# EAGLE design IO4-LED-Strip-Driver (EAGLE 7.7.0)
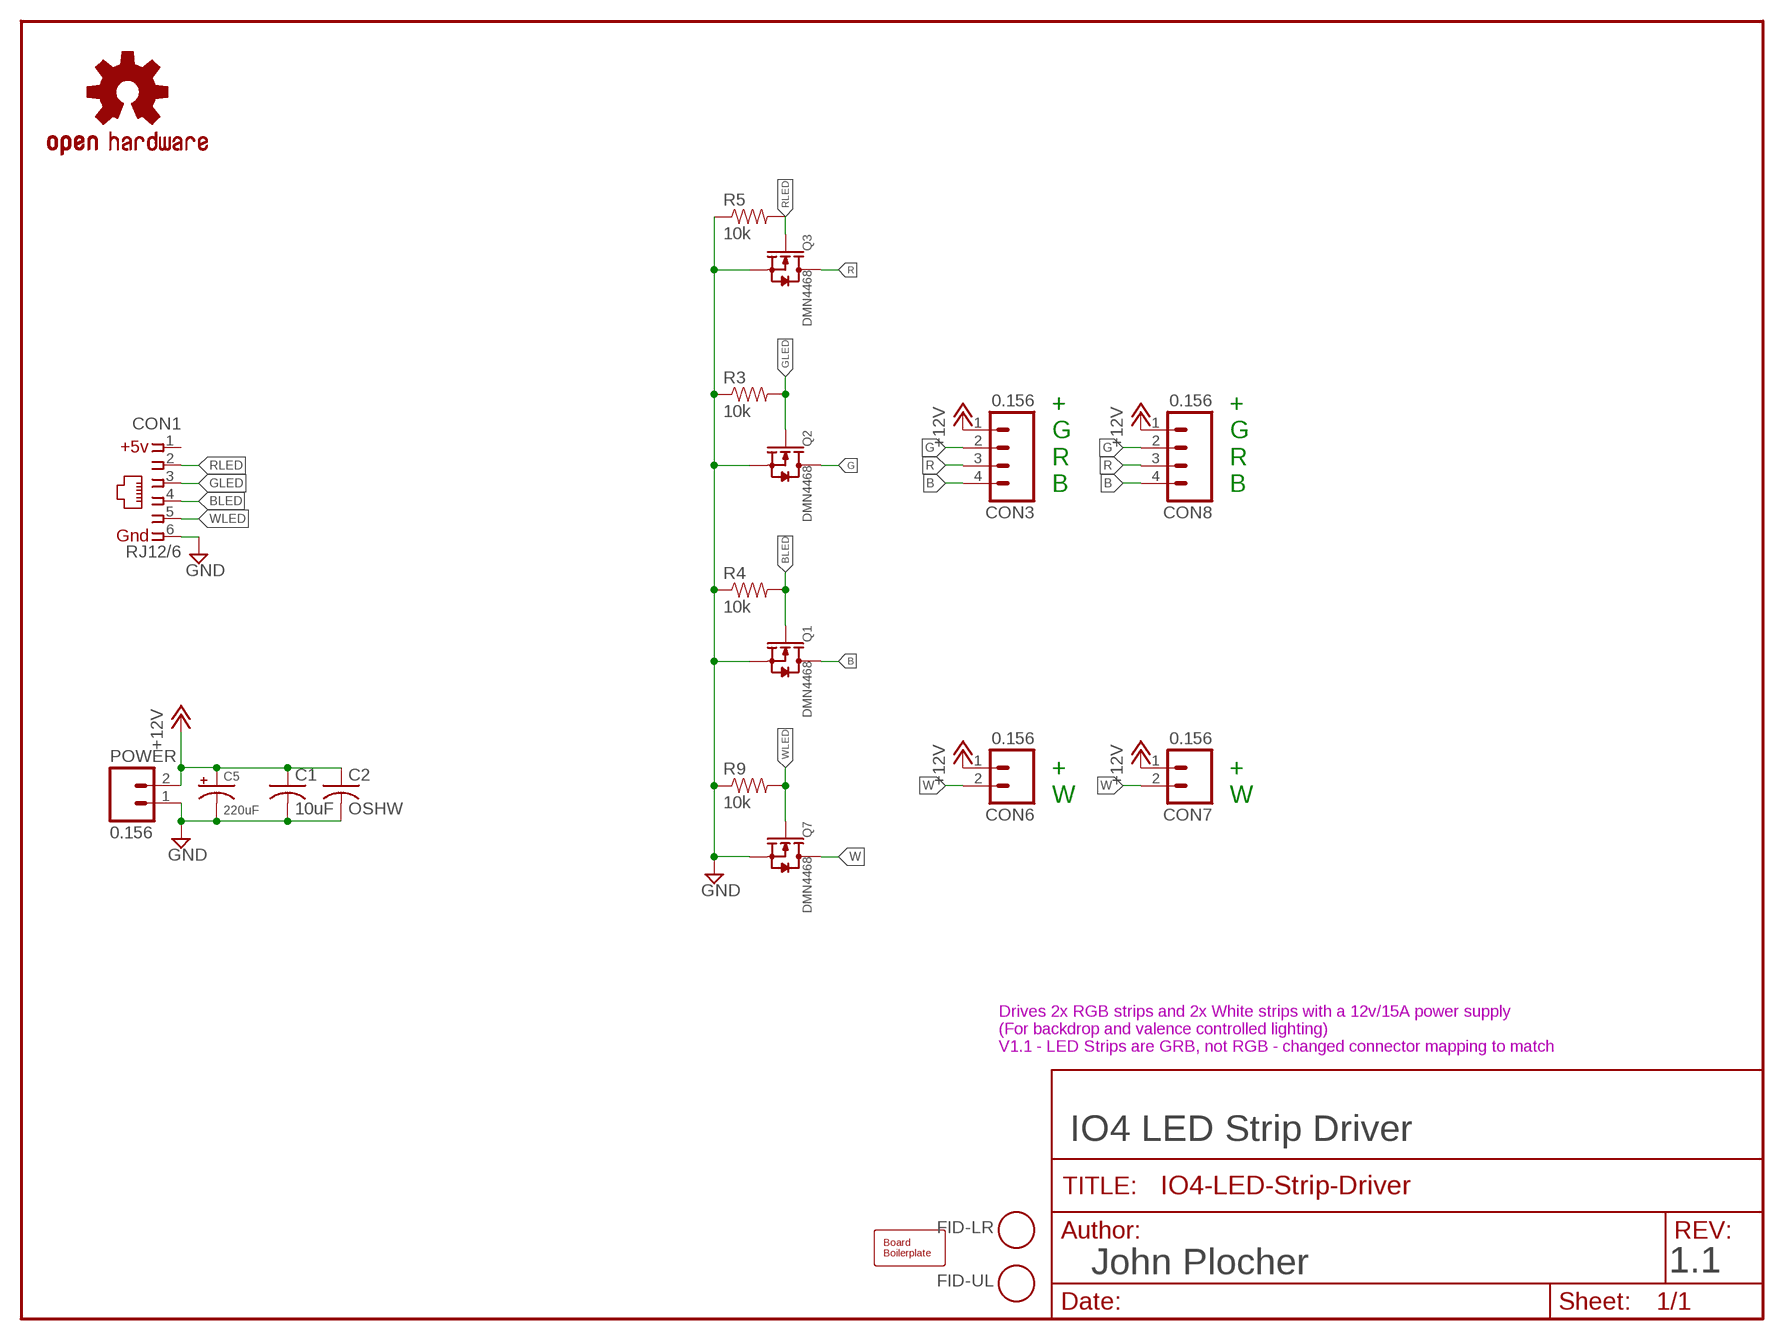
[diagram p0: schematic, sheet 1]

## Parts
BOARD1  BOARD  BOARD80X100  [BOARD-DINRAIL-3.17INX10CM]
C1  10uF  CAP0603  [0603-CAP]
C2  OSHW  CAP0603  [0603-CAP]
C5  220uF  CAP-POL0810  [0810-CAP]
CON1  RJ12/6  CONNECTOR-IO4INV  [RJ25-INVERTED]
CON3  0.156  CONNECTOR-M045.08  [MSTBA4]
CON6  0.156  CONNECTOR-M02MSTBA2  [MSTBA2]
CON7  0.156  CONNECTOR-M02MSTBA2  [MSTBA2]
CON8  0.156  CONNECTOR-M045.08  [MSTBA4]
FID-LR  FIDUCIAL  [FIDUCIAL_1MM]
FID-UL  FIDUCIAL  [FIDUCIAL_1MM]
OSHW1  OSHW  OSHW-LOGOL  [OSHW-LOGO-L]
POWER  0.156  CONNECTOR-M02MSTBA2  [MSTBA2]
Q1  DMN4468  MOSFET-N--SO8  [SO08]
Q2  DMN4468  MOSFET-N--SO8  [SO08]
Q3  DMN4468  MOSFET-N--SO8  [SO08]
Q7  DMN4468  MOSFET-N--SO8  [SO08]
R3  10k  R0603-RES  [0603-RES]
R4  10k  R0603-RES  [0603-RES]
R5  10k  R0603-RES  [0603-RES]
R9  10k  R0603-RES  [0603-RES]

## Nets
+12V [Feed]: C1.1 C2.1 C5.+ CON3.1 CON6.1(A) CON7.1(A) CON8.1 POWER.2(B)
B: CON3.4 CON8.4 Q1.5(D) Q1.6(D) Q1.7(D) Q1.8(D)
BLED: CON1.4 Q1.4(G) R4.2
G: CON3.2 CON8.2 Q2.5(D) Q2.6(D) Q2.7(D) Q2.8(D)
GLED: CON1.3 Q2.4(G) R3.2
GND: C1.2 C2.2 C5.- CON1.6 POWER.1(A) Q1.1(S) Q1.2(S) Q1.3(S) Q2.1(S) Q2.2(S) Q2.3(S) Q3.1(S) Q3.2(S) Q3.3(S) Q7.1(S) Q7.2(S) Q7.3(S) R3.1 R4.1 R5.1 R9.1
R: CON3.3 CON8.3 Q3.5(D) Q3.6(D) Q3.7(D) Q3.8(D)
RLED: CON1.2 Q3.4(G) R5.2
W: CON6.2(B) CON7.2(B) Q7.5(D) Q7.6(D) Q7.7(D) Q7.8(D)
WLED: CON1.5 Q7.4(G) R9.2

## Notes on the sheet
- +
  G
  R
  B
- +
  G
  R
  B
- +
  W
- +
  W
- Drives 2x RGB strips and 2x White strips with a 12v/15A power supply
  (For backdrop and valence controlled lighting)
  V1.1 - LED Strips are GRB, not RGB - changed connector mapping to match
- IO4 LED Strip Driver
- John Plocher | 1.1

## Power pins joined to a net without a drawn wire
1: CON1.1

## Library data of the parts
BOARD1 = SPCoast:BOARD
C1 C2 = SPCoast:CAP*
C5 = SPCoast:CAP-POL*
CON1 = SPCoast:CONNECTOR-IO4
CON3 CON8 = SPCoast:CONNECTOR-M04: Header 4 Standard 4-pin 0.1" header. Use with straight break away headers (SKU : PRT-00116), right angle break away headers (PRT-00553), swiss pins (PRT-00743), machine pins (PRT-00117), and female headers (PRT-00115). Molex polarized connector foot print use with SKU : PRT-08231 with associated crimp pins and housings. 1MM SMD Version SKU: PRT-10208
CON6 CON7 POWER = SPCoast:CONNECTOR-M02: PHOENIX CONNECTOR
FID-LR FID-UL = SPCoast:FIDUCIAL: For use by pick and place machines to calibrate the vision/machine, 1mm By microbuilder.eu
OSHW1 = SparkFun:OSHW-LOGO: Open Source Hardware Logo This logo indicates the piece of hardware it is found on incorporates a OSHW license and/or adheres to the definition of open source hardware found here: http://freedomdefined.org/OSHW
Q1-Q3 Q7 = SPCoast:MOSFET-N-*-?: CJ2302：SMD MOSFET N-CH 20V-2.1A DMN4468 - SO8 30v/10A
R3-R5 R9 = SPCoast:R*: Resistor Basic schematic elements and footprints for 0603, 1206, and PTH 1/10th watt (small) resistors.

## Net classes
0 default: width 0.254 mm, drill 0.5 mm, clearance 0.203 mm
1 Power: width 0.406 mm, drill 0.6 mm, clearance 0.203 mm
2 signals: width 0.305 mm, drill 0.6 mm, clearance 0.203 mm
3 Feed: width 1.016 mm, drill 1.4 mm, clearance 0.203 mm

## Board
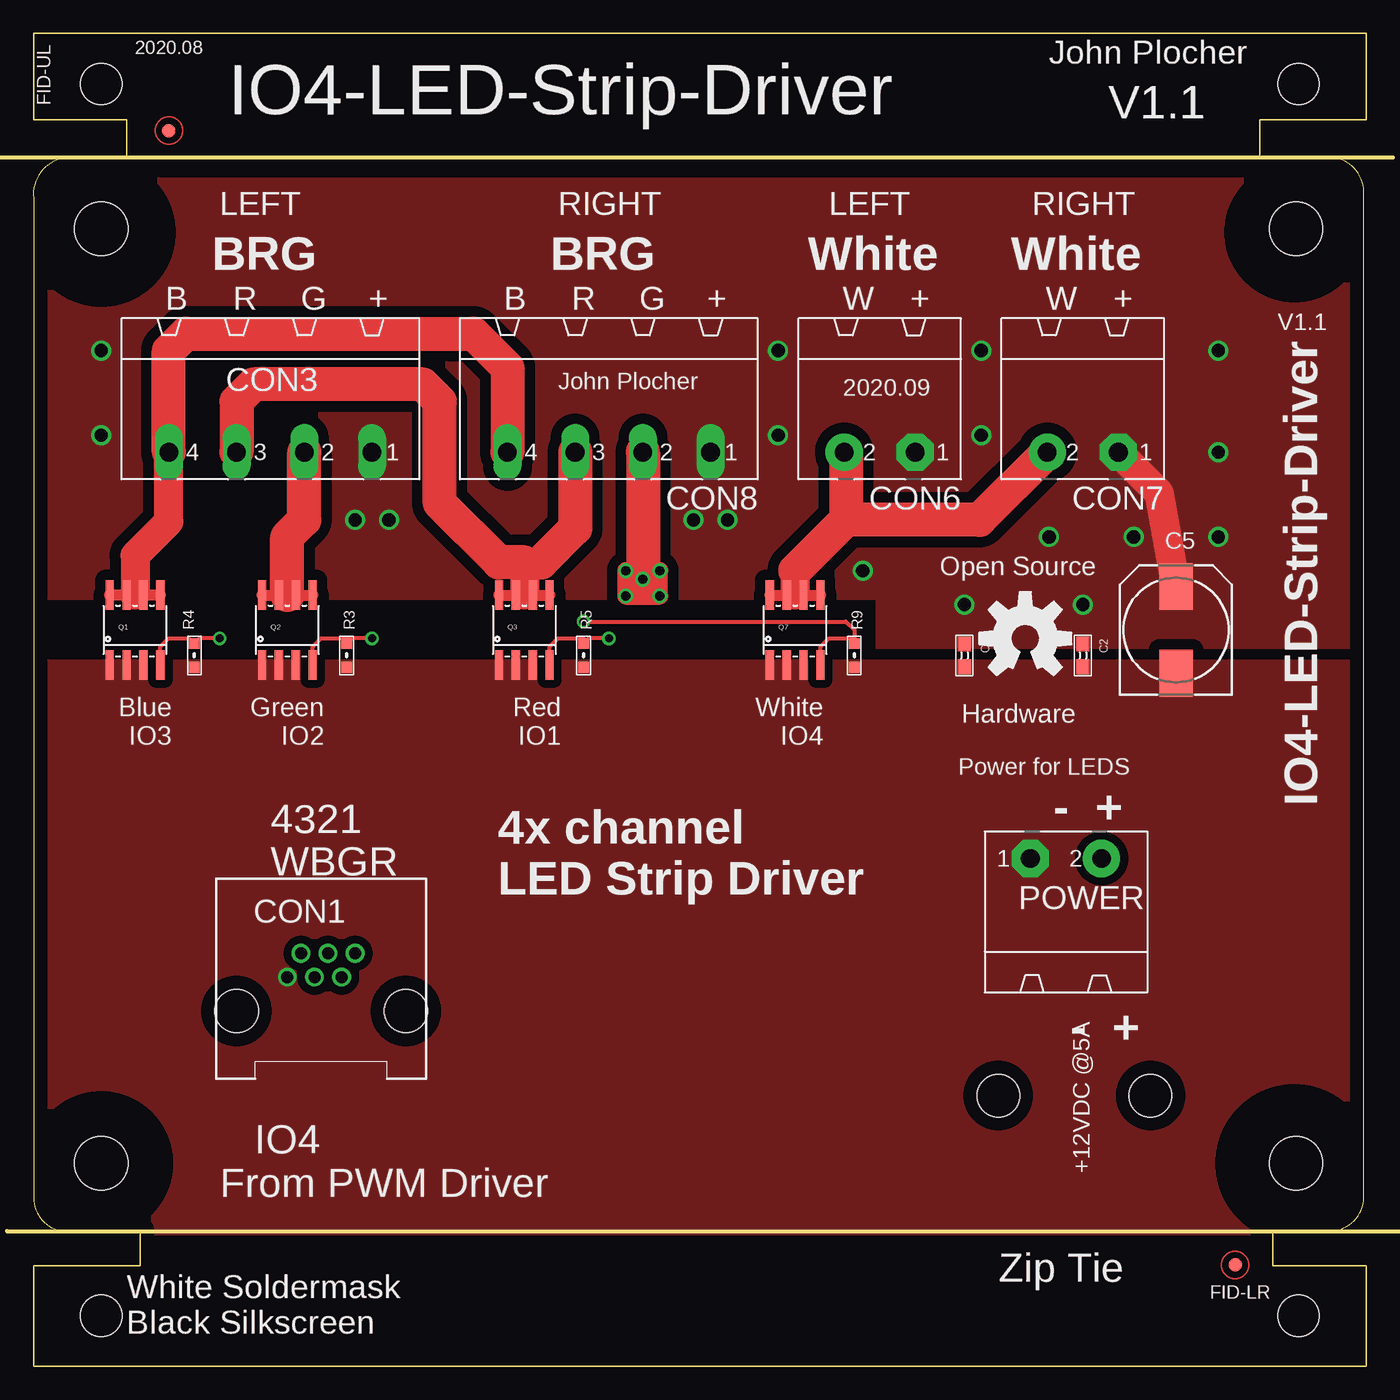
[diagram p1: board, top side]
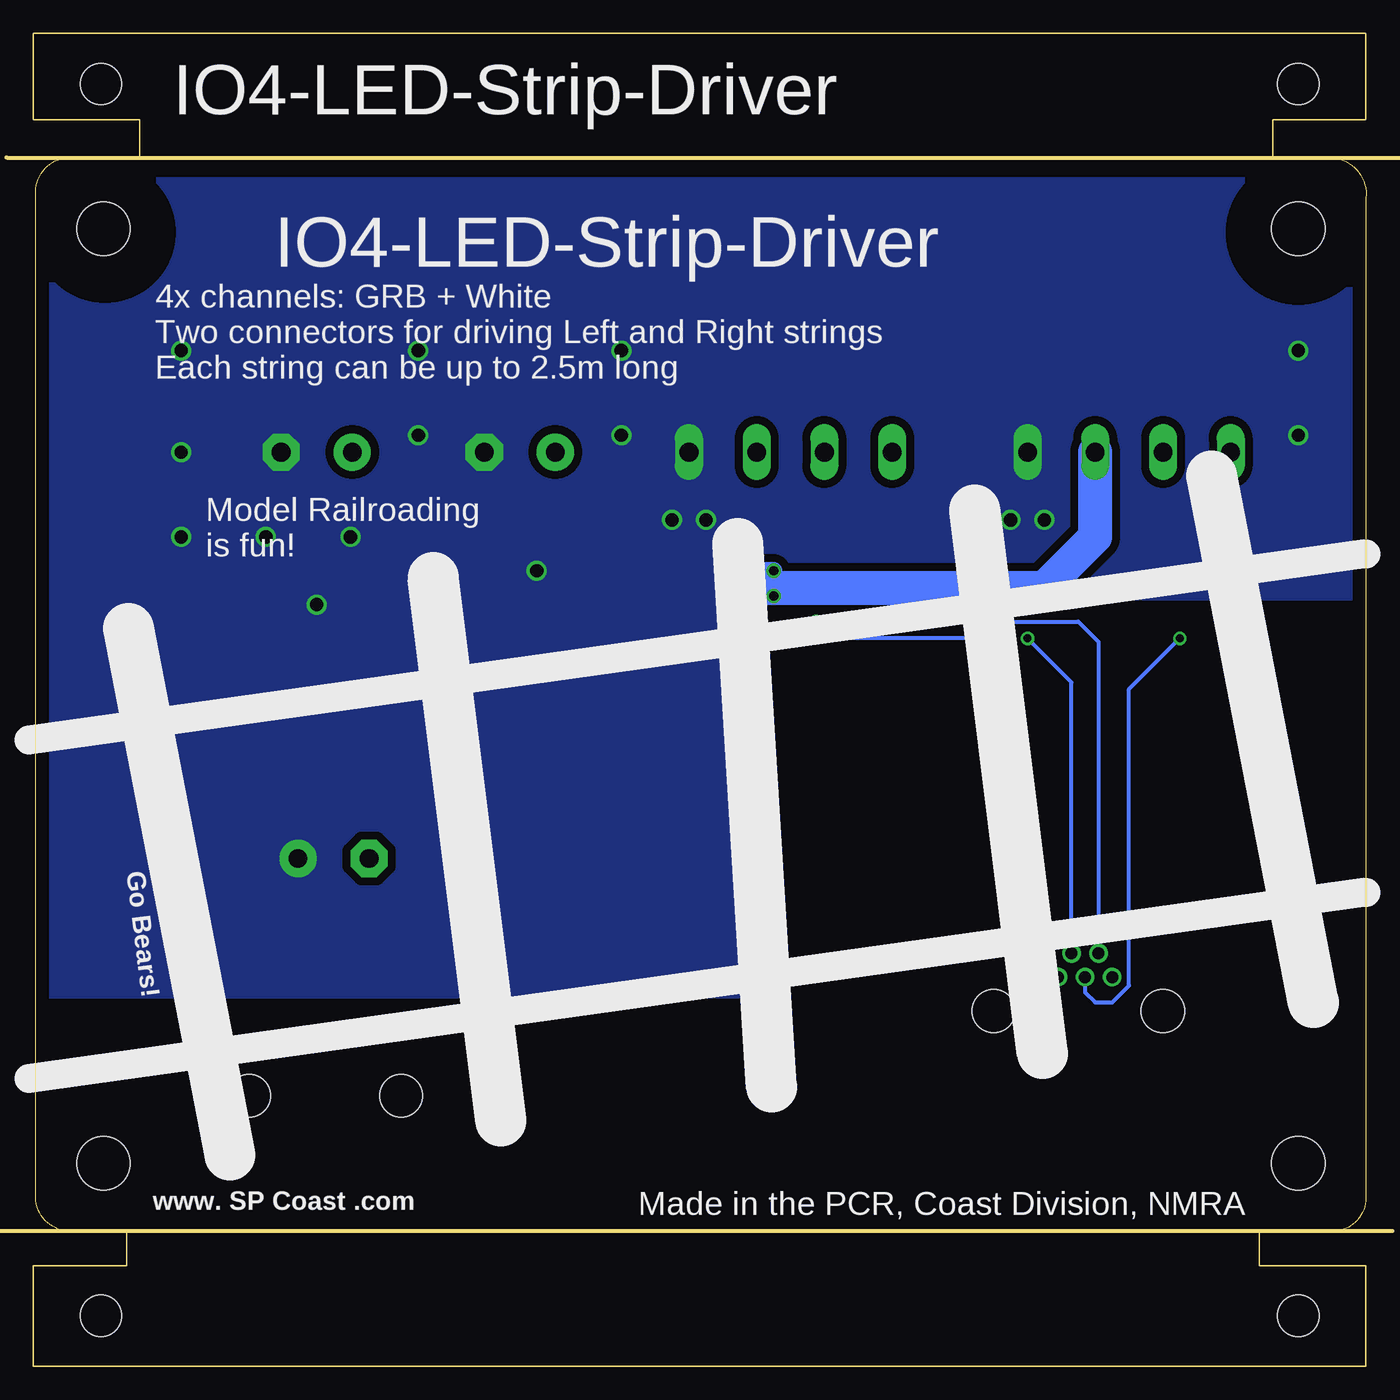
[diagram p2: board, bottom side, seen from below]

Size 100.01 x 100 mm. Coordinates in mm from the lower left corner, seen from the top.
Copper layers (1*16): Top 0.035mm / dielectric 1.5mm / Bottom 0.035mm
Design rules "default": minimum track width 10mil, minimum drill 0.6mm, track to track 8mil, track to pad 8mil, pad to pad 8mil, via to via 8mil, smd to smd 8mil, copper to edge 40mil, drill to drill 8mil, minimum pad ring 10mil, minimum via ring 8mil, stop-mask expansion 4mil, vias tented up to drill 0mil, thermal gap 10mil
Holes 3.2 mm at 83.83,20.32 72.4,20.32
tRestrict: area 0.5,80.5 to 9.7,89.7; area 90.4,80.8 to 98.9,89.3; area 89.5,10.1 to 99.7,20.4; area 0.5,10.7 to 9.7,19.8
bRestrict: area 0.5,80.5 to 9.7,89.7; area 90.1,80.6 to 99.1,89.6; area 0.5,10.7 to 9.7,19.8; area 89.5,10.1 to 99.7,20.4

### Footprints (pad centres in the part's own frame; a part is rotated, then mirrored left to right if it is on the bottom)
BOARD-DINRAIL-3.17INX10CM = hole 4: 94.742,15.24; 5.08,85.344; 94.742,85.344; 5.08,15.24 | hole 3.1: 5.08,96.19; 94.92,96.19; 5.08,3.81; 94.92,3.81
0603-CAP = smd 1.1 x 1: 1 -0.85,0; 2 0.85,0
0810-CAP = smd 3.5 x 2.5: + 3.25,0; - -3.25,0
RJ25-INVERTED = drill 0.9 pad 1.4: 1 2.54,4.318; 2 1.524,2.54; 3 0.508,4.318; 4 -0.508,2.54; 5 -1.524,4.318; 6 -2.54,2.54 | hole 3.251: -6.35,0; 6.35,0
MSTBA4 = drill 1.397 long: 1 -7.62,5.08; 2 -2.54,5.08; 3 2.54,5.08; 4 7.62,5.08
MSTBA2 = drill 1.397 pad 2.794 octagon: 1 -2.667,5.08 | drill 1.397 pad 2.794: 2 2.667,5.08
FIDUCIAL_1MM = smd 1 x 1: 1 0,0
SO08 = smd 0.61 x 2.21: 1 -1.905,-2.616; 2 -0.635,-2.616; 3 0.635,-2.616; 4 1.905,-2.616; 5 1.905,2.616; 6 0.635,2.616; 7 -0.635,2.616; 8 -1.905,2.616
0603-RES = smd 0.813 x 0.813: 1 -0.889,0; 2 0.889,0

### Placement (x,y rotation side)
BOARD1  0.01,0 0 top
C1  69.86,53.34 270 top
C2  78.75,53.34 270 top
C5  85.74,55.24 90 top
CON1  21.6,26.67 0 top
CON3  17.79,73.66 180 top
CON6  63.51,73.66 180 top
CON7  78.75,73.66 180 top
CON8  43.19,73.66 180 top
FID-LR  90.18,7.62 0 top
FID-UL  10.17,92.71 0 top
OSHW1  74.44,54.61 0 top
POWER  77.48,33.02 0 top
Q1  7.63,55.24 0 top
Q2  19.06,55.24 0 top
Q3  36.84,55.24 0 top
Q7  57.16,55.24 0 top
R3  23.51,53.34 90 top
R4  12.08,53.34 90 top
R5  41.29,53.34 90 top
R9  61.61,53.34 90 top

### Tracks (layer width: path | path; a pad name or v marks a point on that pad's centre or on a via)
+12V  (via drill 1)
  Top 2.184: CON7.1 84.47,65.53 C5.+
  other vias: 69.86,57.15 78.75,57.15 82.56,62.23 88.91,62.23 76.21,62.23 62.24,59.69 88.91,68.58 71.13,69.85 55.89,69.85 24.14,63.5 26.68,63.5 49.54,63.5 52.08,63.5 55.89,76.2 71.13,76.2 88.91,76.2 5.09,76.2 5.09,69.85
  pour Bottom (isolate 0.61, rank 2, no thermals): 47,27.94 47,57.78 0.01,57.78 0.01,88.9 99.07,88.9 99.07,27.94
  pour Top (isolate 0.813, rank 3, no thermals): 63.51,53.34 63.51,57.78 0.01,57.78 0.01,88.9 100.34,88.9 100.34,53.34
B
  Top 0.813: Q1.5 Q1.6 | Q1.8 Q1.7 7.63,57.86 Q1.6 | 8.78,57.86 Q1.6
  Top 2.184: CON3.4 10.17,63.37 7.63,60.83 7.63,57.86
  Top 2.54: CON3.4 10.17,76.2 11.44,77.47 33.03,77.47 35.57,74.93 CON8.4
BLED  (via drill 0.6)
  Top 0.305: Q1.4 9.54,53.98 10.17,54.61 11.66,54.61 R4.2 12.5,54.61 v13.98,54.61
  Bottom 0.305: CON1.4 21.1,28.07 20.33,27.3 19.06,27.3 17.79,28.57 17.79,50.8 v13.98,54.61
G  (via drill 0.7)
  Top 0.61: Q2.7 19.06,57.86 Q2.6
  Top 0.813: Q2.8 Q2.7 | Q2.6 Q2.5
  Top 1.27: v47,59.69 v44.46,59.69 v44.46,57.78 v47,57.78 v47,59.69 | v47,59.69 46.37,59.69 v45.73,59.05
  Top 2.54: 19.06,57.86 19.06,62.23 20.33,63.5 CON3.2 | CON8.2 v45.73,59.05
  Bottom 1.27: v44.46,59.69 v47,59.69 v47,57.78 v44.46,57.78 v44.46,59.69 | v44.46,59.69 45.1,59.69 v45.73,59.05
  Bottom 2.184: v45.73,59.05 45.1,58.42
  Bottom 2.54: 45.1,58.42 24.14,58.42 20.33,62.23 CON3.2
GLED  (via drill 0.6)
  Top 0.305: Q2.4 20.97,53.98 21.6,54.61 23.51,54.61 | 23.51,54.61 R3.2 23.93,54.61 | v25.41,54.61 23.51,54.61
  Bottom 0.305: CON1.3 22.11,51.31 v25.41,54.61
GND
  pour Top (isolate 0.61, no thermals): 100.34,52.7 0.01,52.7 0.01,10.16 100.34,10.16
R
  Top 0.813: Q3.8 Q3.7 36.84,57.86 Q3.6 Q3.5
  Top 2.184: 36.84,57.86 36.84,60.33 38.11,60.33
  Top 2.54: CON8.3 40.65,62.87 38.11,60.33 | 36.84,60.33 34.94,60.33 30.49,64.77 30.49,72.39 29.22,73.66 16.52,73.66 15.25,72.39 CON3.3
RLED  (via drill 0.6)
  Top 0.305: Q3.4 38.75,53.98 39.38,54.61 41.29,54.61 R5.2 41.71,54.61 v43.19,54.61
  Bottom 0.305: v43.19,54.61 29.22,54.61 26.05,51.44 26.05,30.48 24.78,29.21 CON1.2
W
  Top 0.813: Q7.8 Q7.7 57.16,57.86 Q7.6 Q7.5
  Top 2.184: CON6.2 60.97,68.45 | 57.16,59.69 57.16,57.86
  Top 2.54: 60.97,68.45 60.97,63.5 | 60.97,63.5 57.16,59.69 | CON7.2 71.01,63.5 60.97,63.5
WLED  (via drill 0.6)
  Top 0.305: Q7.4 59.07,53.98 59.7,54.61 61.61,54.61 | v41.29,55.88 60.97,55.88 61.61,55.24 61.61,54.61 | 61.61,54.61 R9.2
  Bottom 0.305: v41.29,55.88 21.6,55.88 20.08,54.36 CON1.5

### Text on the board
tPlace: 2020.08 | John Plocher | V1.1 | LEFT | RIGHT | LEFT | RIGHT | BRG | BRG | White | White | B | R | G | + | B | R | G | + | W | + | W | + | V1.1 | 2020.09 | John Plocher | Open Source | Blue / IO3 | Green / IO2 | Red / IO1 | White / IO4 | Hardware | Power for LEDS | - + | 4321 | WBGR | 4x channel / LED Strip Driver | - + | +12VDC @5A | IO4 / From PWM Driver | Zip Tie | White Soldermask / Black Silkscreen
bPlace: 4x channels: GRB + White / Two connectors for driving Left and Right strings / Each string can be up to 2.5m long | Model Railroading / is fun! | Go Bears! | Made in the PCR, Coast Division, NMRA | www. SP Coast .com